# Altium schematic sheet Sce_ES2 (1).schdoc
size B; SheetNumber: 1; SheetTotal: 1
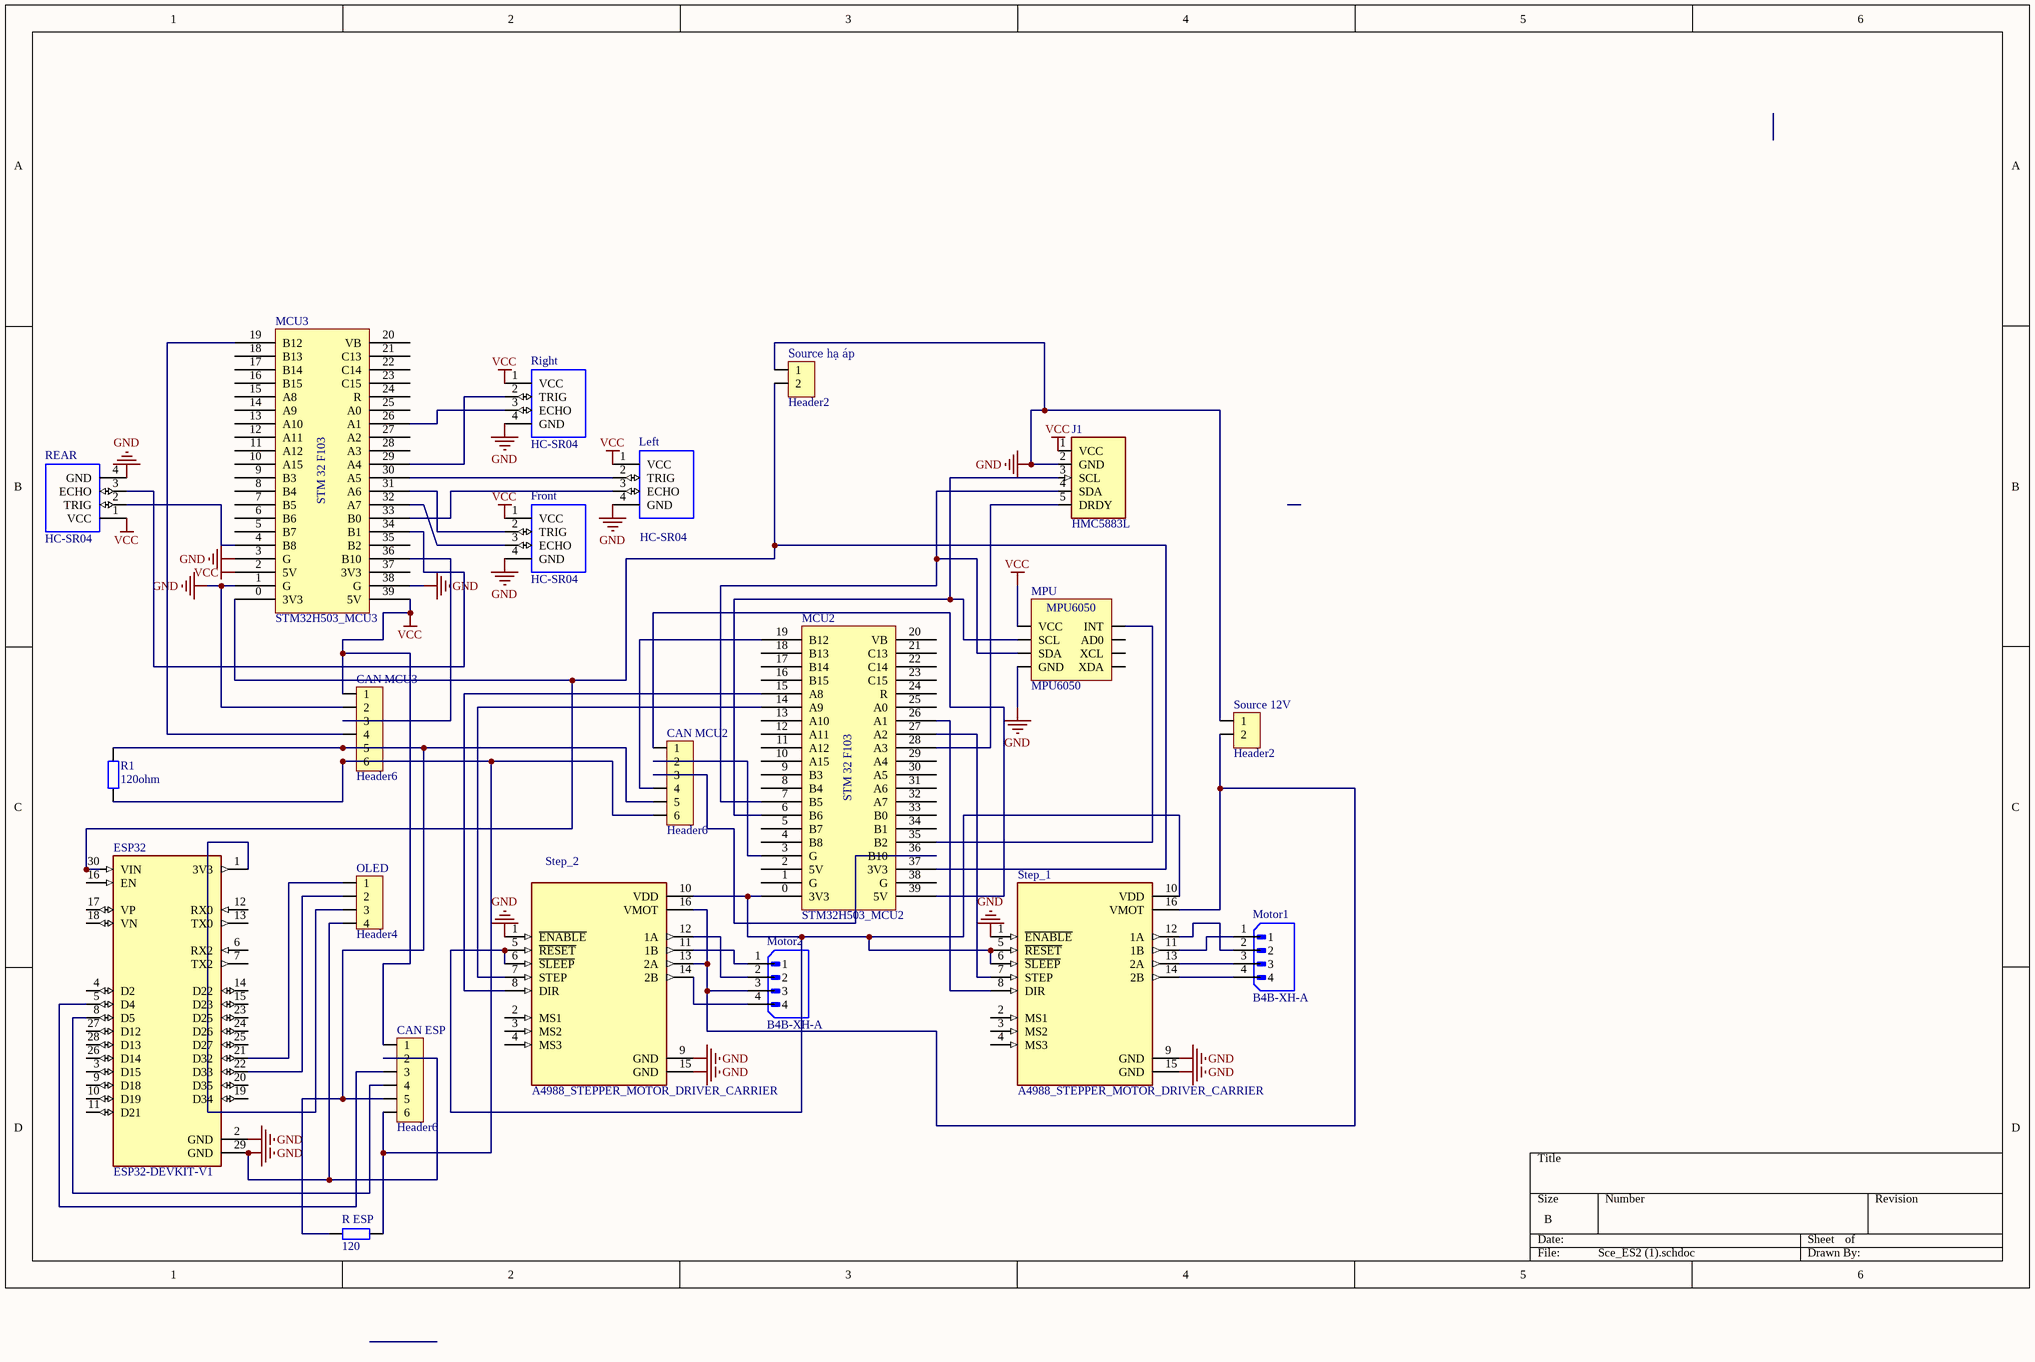
[diagram p0: Sce_ES2 (1).schdoc]

## Parts
CAN_ESP  Header6  [HDR6]
CAN_MCU2  Header6  [HDR6]
CAN_MCU3  Header6  [HDR6]
ESP32  ESP32-DEVKIT-V1  [MODULE_ESP32_DEVKIT_V1]
Front  HC-SR04  [XCVR_HC-SR04]
J1  HMC5883L  [HMC5883L]
Left  HC-SR04  [XCVR_HC-SR04]
MCU2  STM32H503_MCU2  [STM32F103]
MCU3  STM32H503_MCU3  [STM32F103]
Motor1  B4B-XH-A  [JST_B4B-XH-A]
Motor2  B4B-XH-A  [JST_B4B-XH-A]
MPU  MPU6050  [MPU6050]
OLED  Header4  [HDR4]
R1  120ohm  [R1/2W]
R_ESP  120  [R1/2W]
REAR  HC-SR04  [XCVR_HC-SR04]
Right  HC-SR04  [XCVR_HC-SR04]
Source_12V  Header2  [HDR2]
Source_hạ_áp  Header2  [HDR2]
Step_1  A4988_STEPPER_MOTOR_DRIVER_CARRIER  [MODULE_A4988_STEPPER_MOTOR_DRIVER_CARRIER]
Step_2  A4988_STEPPER_MOTOR_DRIVER_CARRIER  [MODULE_A4988_STEPPER_MOTOR_DRIVER_CARRIER]

## Nets
GND: CAN_ESP.2 CAN_MCU3.2 ESP32.2(GND) ESP32.29(GND) Front.4(GND) J1.2(GND) Left.4(GND) MCU3.1(G) MCU3.3(G) MCU3.38(G) MPU.2(GND) OLED.4 REAR.4(GND) Right.4(GND) Source_12V.1 Source_hạ_áp.1 Step_1.1(~{ENABLE}) Step_1.9(GND) Step_1.15(GND) Step_2.1(~{ENABLE}) Step_2.9(GND) Step_2.15(GND)
VCC: CAN_ESP.1 CAN_MCU3.1 Front.1(VCC) J1.1(VCC) Left.1(VCC) MCU3.2(5V) MCU3.39(5V) MPU.1(VCC) REAR.1(VCC) Right.1(VCC)
NetCAN_ESP_3: CAN_ESP.3 ESP32.5(D4)
NetCAN_ESP_4: CAN_ESP.4 ESP32.8(D5)
NetCAN_ESP_5: CAN_ESP.5 CAN_MCU2.5 CAN_MCU3.5 R1.2 R_ESP.1
NetCAN_ESP_6: CAN_ESP.6 CAN_MCU2.6 CAN_MCU3.6 R1.1 R_ESP.2
NetCAN_MCU2_1: CAN_MCU2.1 MCU2.39(5V)
NetCAN_MCU2_2: CAN_MCU2.2 MCU2.3(G)
NetCAN_MCU2_3: CAN_MCU2.3 MCU2.36(B10)
NetCAN_MCU2_4: CAN_MCU2.4 MCU2.19(B12)
NetCAN_MCU3_3: CAN_MCU3.3 MCU3.36(B10)
NetCAN_MCU3_4: CAN_MCU3.4 MCU3.19(B12)
NetESP32_1: ESP32.1(3V3) OLED.3
NetESP32_21: ESP32.21(D32) OLED.1
NetESP32_22: ESP32.22(D33) OLED.2
NetESP32_30: ESP32.30(VIN) MCU2.37(3V3) MCU3.0(3V3) Source_hạ_áp.2
NetFront_2: Front.2(TRIG) MCU3.31(A6)
NetFront_3: Front.3(ECHO) MCU3.32(A7)
NetJ1_3: J1.3(SCL) MCU2.6(B6) MPU.3(SCL)
NetJ1_4: J1.4(SDA) MCU2.7(B5) MPU.4(SDA)
NetJ1_5: J1.5(DRDY) MCU2.28(A3)
NetLeft_2: Left.2(TRIG) MCU3.30(A5)
NetLeft_3: Left.3(ECHO) MCU3.33(B0)
NetMCU2_0: MCU2.0(3V3) Step_1.5(~{RESET}) Step_1.6(~{SLEEP}) Step_1.10(VDD) Step_2.5(~{RESET}) Step_2.6(~{SLEEP}) Step_2.10(VDD)
NetMCU2_14: MCU2.14(A9) Step_2.7(STEP)
NetMCU2_15: MCU2.15(A8) Step_2.8(DIR)
NetMCU2_26: MCU2.26(A1) Step_1.8(DIR)
NetMCU2_27: MCU2.27(A2) Step_1.7(STEP)
NetMCU2_35: MCU2.35(B2) MPU.8(INT)
NetMCU3_4: MCU3.4(B8) REAR.2(TRIG)
NetMCU3_26: MCU3.26(A1) Right.3(ECHO)
NetMCU3_29: MCU3.29(A4) Right.2(TRIG)
NetMCU3_34: MCU3.34(B1) REAR.3(ECHO)
NetMotor1_1: Motor1.1 Step_1.11(1B)
NetMotor1_2: Motor1.2 Step_1.12(1A)
NetMotor1_3: Motor1.3 Step_1.13(2A)
NetMotor1_4: Motor1.4 Step_1.14(2B)
NetMotor2_1: Motor2.1 Step_2.11(1B)
NetMotor2_2: Motor2.2 Step_2.12(1A)
NetMotor2_3: Motor2.3 Source_12V.2 Step_1.16(VMOT) Step_2.13(2A) Step_2.16(VMOT)
NetMotor2_4: Motor2.4 Step_2.14(2B)

Not connected (* = marked no-connect by the designer): ESP32 3(D15) 4(D2) 6(RX2) 7(TX2) 9(D18) 10(D19) 11(D21) 12(RX0) 13(TX0) 14(D22) 15(D23) 16(EN) 17(VP) 18(VN) 19(D34) 20(D35) 23(D25) 24(D26) 25(D27) 26(D14) 27(D12) 28(D13); MCU2 1(G) 2(5V) 4(B8) 5(B7) 8(B4) 9(B3) 10(A15) 11(A12) 12(A11) 13(A10) 16(B15) 17(B14) 18(B13) 20(VB) 21(C13) 22(C14) 23(C15) 24(R) 25(A0) 29(A4) 30(A5) 31(A6) 32(A7) 33(B0) 34(B1) 38(G); MCU3 5(B7) 6(B6) 7(B5) 8(B4) 9(B3) 10(A15) 11(A12) 12(A11) 13(A10) 14(A9) 15(A8) 16(B15) 17(B14) 18(B13) 20(VB) 21(C13) 22(C14) 23(C15) 24(R) 25(A0) 27(A2) 28(A3) 35(B2) 37(3V3); MPU 5(XDA) 6(XCL) 7(AD0); Step_1 2(MS1) 3(MS2) 4(MS3); Step_2 2(MS1) 3(MS2) 4(MS3)

## Notes on the sheet
- (in symbol STM32F103) STM 32 F103

## Library data of the parts
CAN_ESP CAN_MCU2 CAN_MCU3 = Header6: Header IDC, 6 x 1 Pin Vertical 2.54mm Pitch (Non-Boxed, Male); Manufacturer: W¨¹rth Elektronik eiSos GmbH; partNo: 613002143121; ComponentLink1 Description: Manufacturer; ComponentLink2 Description: Datasheet; NoPins: 02; Created Date: 29 March 2013; ComponentLink1URL: http://www.we-online.com; ComponentLink2URL: http://katalog.we-online.de/em/datasheet/6130xx143121.pdf; Created by: Karrer Zheng
ESP32 = ESP32-DEVKIT-V1: Dual core, Wi-Fi: 2.4 GHz up to 150 Mbits/s,BLE (Bluetooth Low Energy) and legacy Bluetooth, 32 bits, Up to 240 MHz; MF: Do it; SnapEDA_Link: https://www.snapeda.com/parts/ESP32-DEVKIT-V1/Do+it/view-part/?ref=snap; Package: None; Value: *; MP: ESP32-DEVKIT-V1; Check_prices: https://www.snapeda.com/parts/ESP32-DEVKIT-V1/Do+it/view-part/?ref=eda
Front Left REAR Right = HC-SR04: Ultrasonic Sensor Module; Availability: Unavailable; MP: HC-SR04; Value: *; Price: None; Package: None
J1 = HMC5883L: Magnetic Sensor Development Tools 3-Axis Digital Compass w 12-Bit ADC; MF: STMicroelectronics; SnapEDA_Link: https://www.snapeda.com/parts/HMC5883L/STMicroelectronics/view-part/?ref=snap; Package: None; Value: *; MP: HMC5883L; Check_prices: https://www.snapeda.com/parts/HMC5883L/STMicroelectronics/view-part/?ref=eda
MCU2 MCU3 = STM32F103
Motor1 Motor2 = B4B-XH-A: Connector Header Through Hole 4 position 0.098 (2.50mm); MF: JST Sales; SnapEDA_Link: https://www.snapeda.com/parts/B4B-XH-A/JST/view-part/?ref=snap; Package: None; Value: *; MP: B4B-XH-A; Check_prices: https://www.snapeda.com/parts/B4B-XH-A/JST/view-part/?ref=eda
MPU = MPU6050: Manufacturer: W¨¹rth Elektronik eiSos GmbH; partNo: 613004143121; ComponentLink1 Description: Manufacturer; ComponentLink2 Description: Datasheet; NoPins: 04; Created Date: 29 March 2013; ComponentLink1URL: http://www.we-online.com; ComponentLink2URL: http://katalog.we-online.de/em/datasheet/6130xx143121.pdf; Created by: Karrer Zheng
OLED = Header4: Header IDC, 4 x 1 Pin Vertical 2.54mm Pitch (Non-Boxed, Male); Manufacturer: W¨¹rth Elektronik eiSos GmbH; partNo: 613002143121; ComponentLink1 Description: Manufacturer; ComponentLink2 Description: Datasheet; NoPins: 02; Created Date: 29 March 2013; ComponentLink1URL: http://www.we-online.com; ComponentLink2URL: http://katalog.we-online.de/em/datasheet/6130xx143121.pdf; Created by: Karrer Zheng
R1 R_ESP = R1/4W: Resistor 1/4W; Value: R1/4W - 1K
Source_12V Source_hạ_áp = Header2: Header IDC, 2 x 1 Pin Vertical 2.54mm Pitch (Non-Boxed, Male); Manufacturer: W¨¹rth Elektronik eiSos GmbH; partNo: 613002143121; ComponentLink1 Description: Manufacturer; ComponentLink2 Description: Datasheet; NoPins: 02; Created Date: 29 March 2013; ComponentLink1URL: http://www.we-online.com; ComponentLink2URL: http://katalog.we-online.de/em/datasheet/6130xx143121.pdf; Created by: Karrer Zheng
Step_1 Step_2 = A4988_STEPPER_MOTOR_DRIVER_CARRIER: Stepper motor controler; IC: A4988; 1A; Uin mot: 8Ã·35V; Price: None; Value: *; MP: A4988_STEPPER_MOTOR_DRIVER_CARRIER; Package: None; Availability: Unavailable